# Altium schematic sheet 232转CAN.SchDoc
size A4
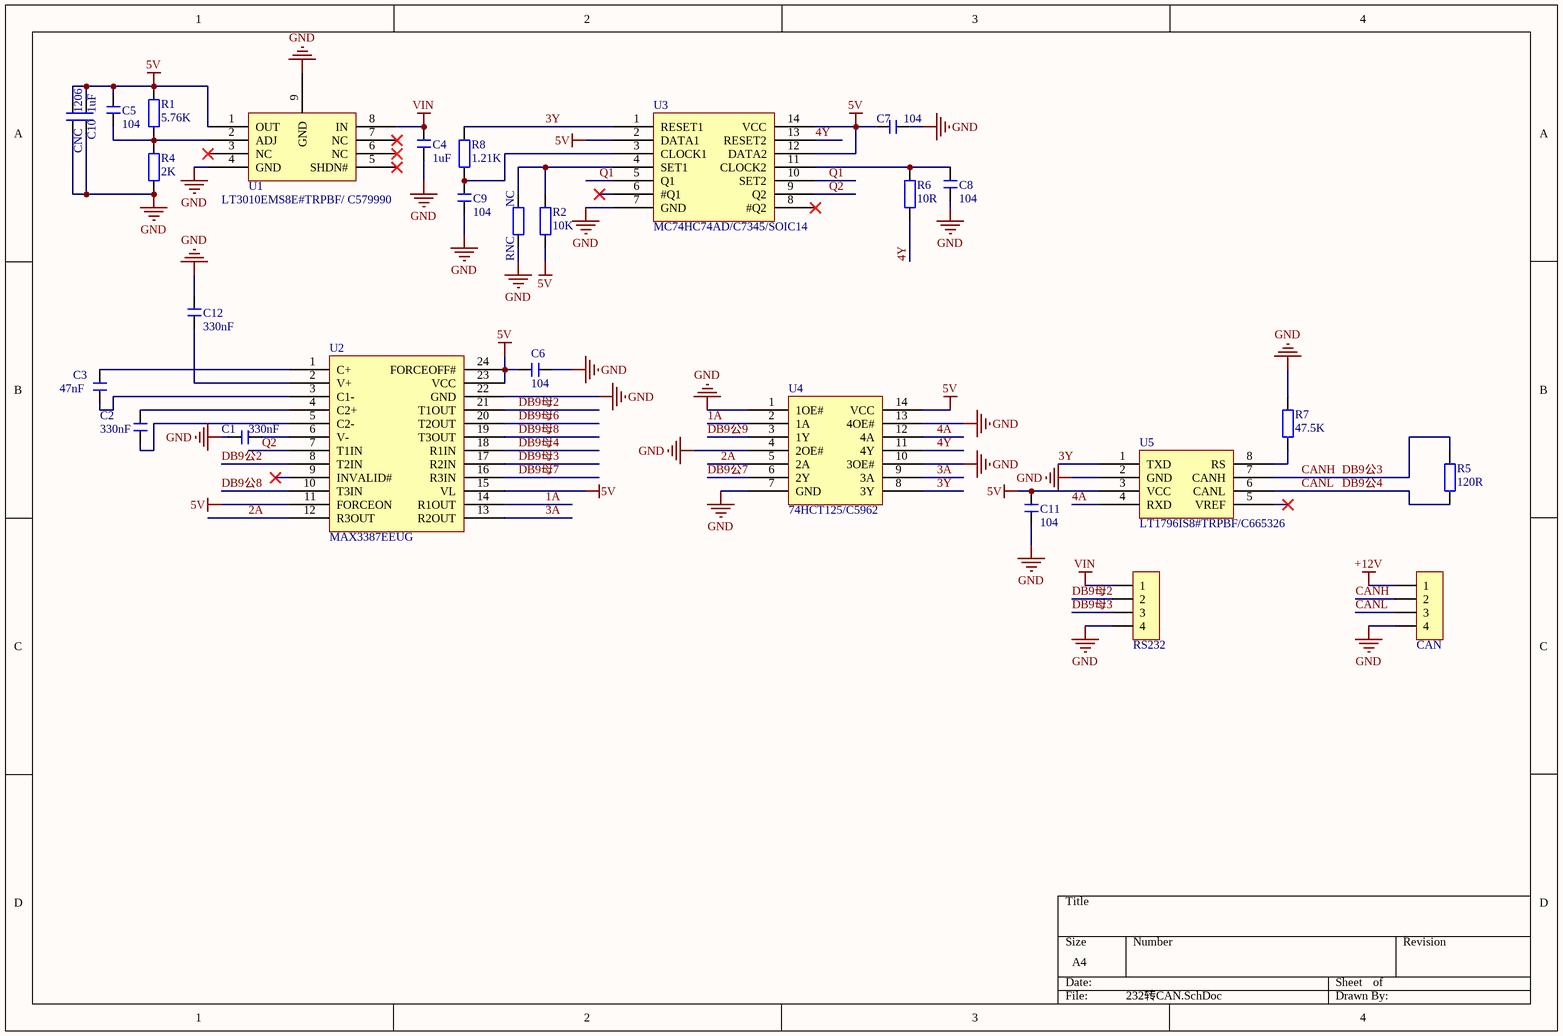
[diagram p0: 232转CAN.SchDoc]

## Parts
C1  330nF  [C0603_L]
C2  330nF  [C0603_L]
C3  47nF  [C0603_L]
C4  1uF  [C0603_L]
C5  104  [C0603_L]
C6  104  [C0603_L]
C7  104  [C0603_L]
C8  104  [C0603_L]
C9  104  [C0603_L]
C10  1uF  [C0603_L]
C11  104  [C0603_L]
C12  330nF  [C0603_L]
CAN  HDR-1X4  [HDR2.54-LI-4P]  (value not drawn)
CNC  1206  [C1206_L]
R1  5.76K  [R0603_L]
R2  10K  [R0603_L]
R4  2K  [R0603_L]
R5  120R  [R0603_L]
R6  10R  [R0603_L]
R7  47.5K  [R0603_L]
R8  1.21K  [R0603_L]
RNC  NC  [R0603_L]
RS232  HDR-1X4  [HDR2.54-LI-4P]  (value not drawn)
U1  LT3010EMS8E#TRPBF/ C579990  [LT3010EMS8E#TRPBF/sop8-ep]
U2  MAX3387EEUG  [MAX3387EEUG/tssop24]
U3  MC74HC74AD/C7345/SOIC14  [74HCT125/SOIC14]
U4  74HCT125/C5962  [74HCT125/SOIC14]
U5  LT1796IS8#TRPBF/C665326  [LT1796IS8#TRPBF/C665326]

## Nets
5V: C5.2 C6.2 C7.1 C10.2 C11.1 CNC.2 R1.2 R2.2 U1.1(OUT) U2.11(FORCEON) U2.15(VL) U2.23(VCC) U2.24(FORCEOFF#) U3.2(DATA1) U3.12(DATA2) U3.14(VCC) U4.14(VCC) U5.3(VCC)
+12V: CAN.1
GND: C1.2 C4.1 C6.1 C7.2 C8.2 C9.1 C10.1 C11.2 C12.2 CAN.4 CNC.1 R4.1 R7.1 RNC.2 RS232.4 U1.4(GND) U1.9(GND) U2.22(GND) U3.7(GND) U4.1(1OE#) U4.4(2OE#) U4.7(GND) U4.10(3OE#) U4.13(4OE#) U5.2(GND)
VIN: C4.2 RS232.1 U1.8(IN)
1A: U2.14(R1OUT) U4.2(1A)
2A: U2.12(R3OUT) U4.5(2A)
3A: U2.13(R2OUT) U4.9(3A)
3Y: R8.1 U3.1(RESET1) U4.8(3Y) U5.1(TXD)
4A: U4.12(4A) U5.4(RXD)
4Y: R6.2 U3.13(RESET2) U4.11(4Y)
CANH: CAN.2 R5.1 U5.7(CANH)  [also labelled DB9公3]
CANL: CAN.3 R5.2 U5.6(CANL)  [also labelled DB9公4]
DB9公2: U2.8(T2IN)
DB9公7: U4.6(2Y)
DB9公8: U2.10(T3IN)
DB9公9: U4.3(1Y)
DB9母2: RS232.2 U2.21(T1OUT)
DB9母3: RS232.3 U2.17(R2IN)
DB9母4: U2.18(R1IN)
DB9母6: U2.20(T2OUT)
DB9母7: U2.16(R3IN)
DB9母8: U2.19(T3OUT)
Q1: U3.5(Q1) U3.10(SET2)
Q2: U2.7(T1IN) U3.9(Q2)
NetC1_1: C1.1 U2.6(V-)
NetC2_1: C2.1 U2.5(C2-)
NetC2_2: C2.2 U2.4(C2+)
NetC3_1: C3.1 U2.3(C1-)
NetC3_2: C3.2 U2.1(C+)
NetC5_1: C5.1 R1.1 R4.2 U1.2(ADJ)
NetC8_1: C8.1 R6.1 U3.11(CLOCK2)
NetC9_2: C9.2 R8.2 U3.3(CLOCK1)
NetC12_1: C12.1 U2.2(V+)
NetR2_1: R2.1 RNC.1 U3.4(SET1)
NetR7_2: R7.2 U5.8(RS)

Not connected (* = marked no-connect by the designer): U1 3(NC)* 5(SHDN#)* 6(NC)* 7(NC)*; U2 9(INVALID#)*; U3 6(#Q1)* 8(#Q2)*; U5 5(VREF)*

## Library data of the parts
C1-C4 C6-C12 CNC = C-MLCC: 独石电容; 版权归属: 封装库来自淘宝 ID：黄晶宝石; 封装库来自淘宝卖家 ID：黄晶宝石: 他店铺购入均为盗版，不享受售后技术支持服务，请立即申请退款; BOM名称: 独石电容; 联系售后: https://item.taobao.com/item.htm?id=566775463719
C5 = C: 贴片电容; BOM名称: 无极性贴片电容; 淘宝ID: 封装库来自淘宝 ID：黄晶宝石; 联系售后，技术支持: https://shop463601444.taobao.com; 唯一出售店铺网址: https://shop463601444.taobao.com
CAN RS232 = Header 4: 4P接插件; 版权归属: 封装库来自淘宝 ID：黄晶宝石; 学习资源: 最新版本发布https://item.taobao.com/item.htm?id=566775463719; BOM名称: 4P接插件
R1 R2 R4-R8 RNC = R: 贴片电阻; 版权归属: 来自淘宝 ID：黄晶宝石; 封装库来自淘宝卖家 ID：黄晶宝石: 其他店铺购入均为盗版，不享受售后技术支持服务，请立即申请退款; BOM名称: 贴片电阻; 联系售后: https://item.taobao.com/item.htm?id=566775463719